# Altium schematic sheet Pg12_USB_UART.SchDoc: UART - USB CONSOLE & JTAG
size A3; DocumentNumber: 12; SheetNumber: 12; SheetTotal: 16
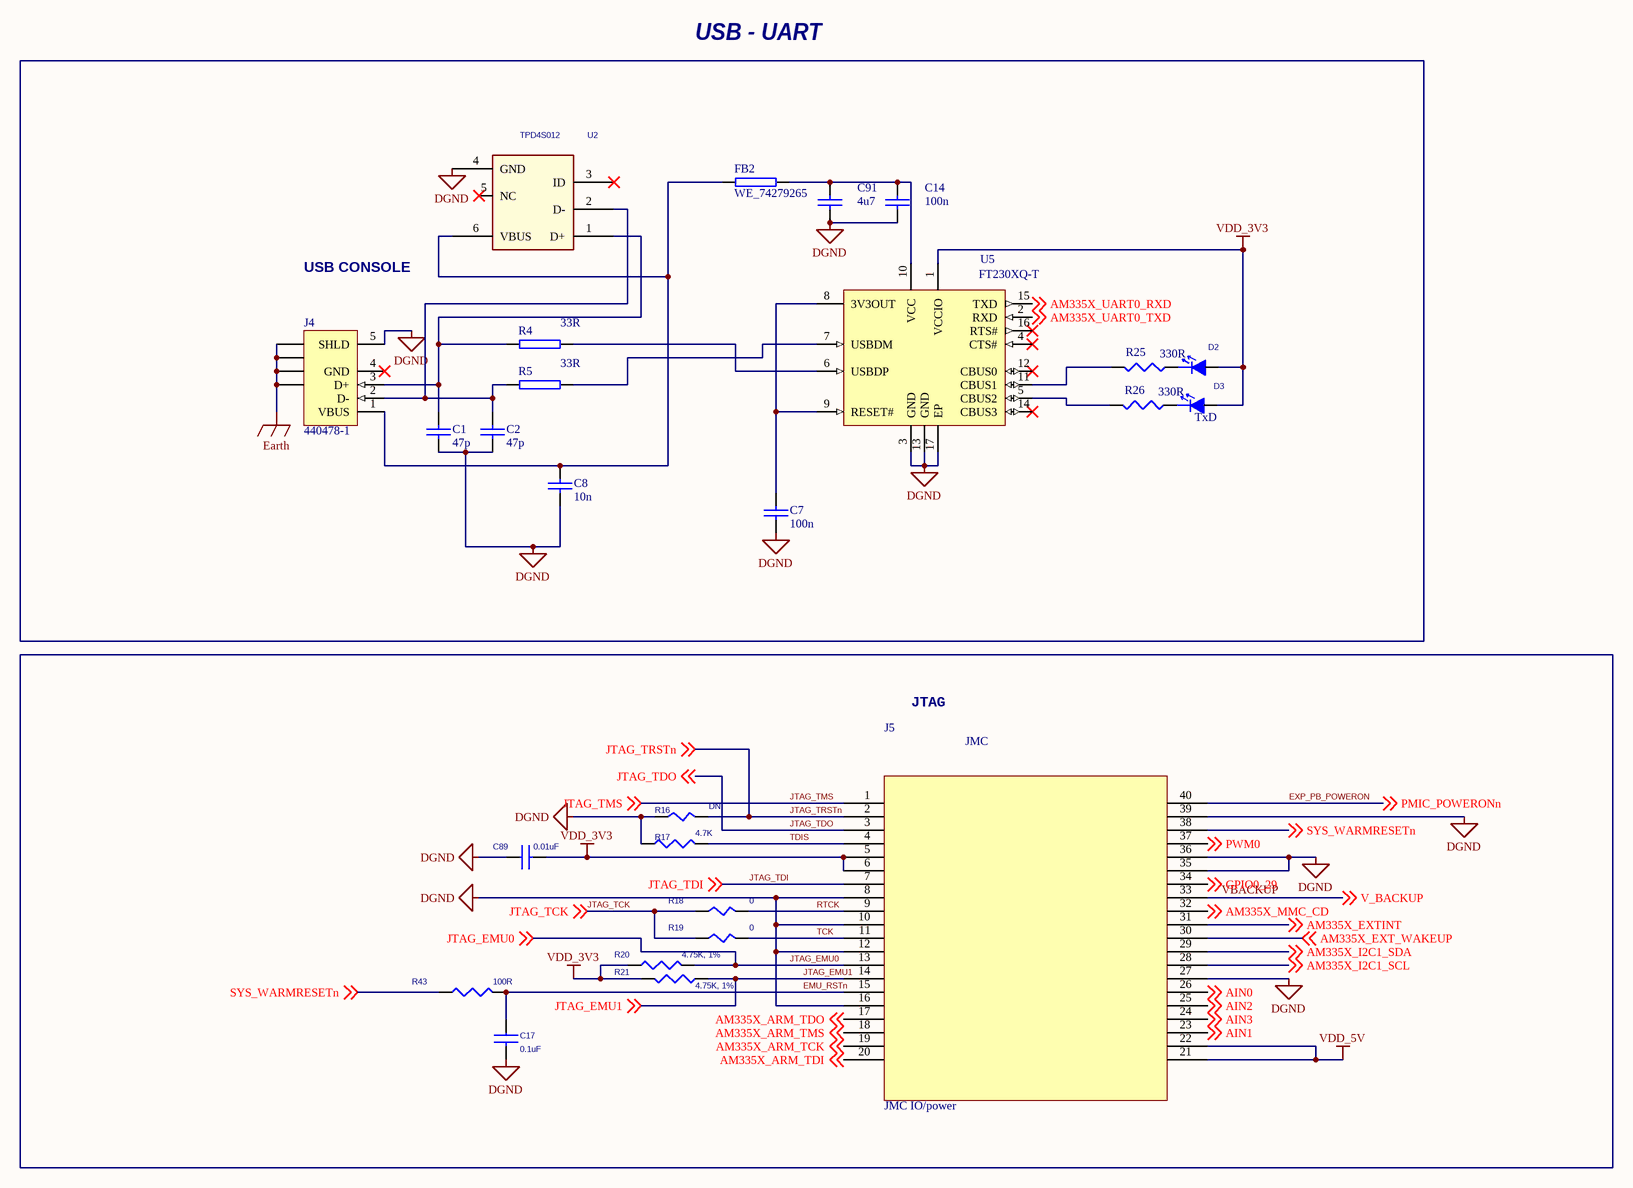
[diagram p0: Pg12_USB_UART.SchDoc]

## Parts
?  (no value)  (graphical)
C1  47p  [SM-7351-CAP-0402]
C2  47p  [SM-7351-CAP-0402]
C7  100n  [SM-7351-CAP-0402]
C8  10n  [SM-7351-CAP-0402]
C14  100n  [SM-7351-CAP-0402]
C17  0.1uF  [SM-7351-CAP-0402]
C89  0.01uF  [SM-7351-CAP-0402]
C91  4u7  [0603]
D2  Green LED  [0603]  (value not drawn)
D3  Green LED  [0603]  (value not drawn)
FB2  WE_74279265  [0603]
J4  440478-1  [440478]
J5  JMC IO/power  [40 Pin Female]
R4  33R  [SM-7351-RES-0402]
R5  33R  [SM-7351-RES-0402]
R16  DNI  [SM-7351-RES-0402]
R17  4.7K  [SM-7351-RES-0402]
R18  0  [SM-7351-RES-0402]
R19  0  [SM-7351-RES-0402]
R20  4.75K, 1%  [SM-7351-RES-0402]
R21  4.75K, 1%  [SM-7351-RES-0402]
R25  330R  [SM-7351-RES-0402]
R26  330R  [SM-7351-RES-0402]
R43  100R  [SM-7351-RES-0402]
U2  TPD4S012  [U_6_DRY]
U5  FT230XQ-T  [QFN-16_N]

## Blocks framed on the sheet
USB - UART: C1 C2 C7 C8 C14 C91 D2 D3 FB2 J4 R4 R5 R25 R26 U2 U5
JTAG: C17 C89 J5 R16-R21 R43

## Nets
DGND: C1.2 C2.2 C7.2 C8.2 C14.2 C17.2 C89.1 C91.2 J4.5(SHLD) J5.8 J5.10 J5.12 J5.16 J5.27 J5.35 J5.36 J5.39 R16.2(P2) R17.1 U2.4(GND) U5.3(GND) U5.13(GND) U5.17(EP)
Earth: J4.6(SHLD) J4.7(SHLD) J4.8(SHLD) J4.9(SHLD)
VDD_3V3: C89.2 D2.2(Anode) D3.2(Anode) J5.5 J5.6 R20.1 R21.2 U5.1(VCCIO)
VDD_5V: J5.21 J5.22
AIN0: J5.26 ; off-sheet AIN0
AIN1: J5.23 ; off-sheet AIN1
AIN2: J5.25 ; off-sheet AIN2
AIN3: J5.24 ; off-sheet AIN3
AM335X_ARM_TCK: J5.19 ; off-sheet AM335X_ARM_TCK
AM335X_ARM_TDI: J5.20 ; off-sheet AM335X_ARM_TDI
AM335X_ARM_TDO: J5.17 ; off-sheet AM335X_ARM_TDO
AM335X_ARM_TMS: J5.18 ; off-sheet AM335X_ARM_TMS
AM335X_EXT_WAKEUP: J5.30 ; off-sheet AM335X_EXT_WAKEUP
AM335X_EXTINT: J5.31 ; off-sheet AM335X_EXTINT
AM335X_I2C1_SCL: J5.28 ; off-sheet AM335X_I2C1_SCL
AM335X_I2C1_SDA: J5.29 ; off-sheet AM335X_I2C1_SDA
AM335X_MMC_CD: J5.32 ; off-sheet AM335X_MMC_CD
AM335X_UART0_RXD: U5.15(TXD) ; off-sheet AM335X_UART0_RXD
AM335X_UART0_TXD: U5.2(RXD) ; off-sheet AM335X_UART0_TXD
EMU_RSTn: C17.1 J5.15 R43.1(P1)
EXP_PB_POWERON: J5.40 ; off-sheet PMIC_POWERONn  [also labelled PMIC_POWERONn]
GPIO0_29: J5.34 ; off-sheet GPIO0_29
JTAG_EMU0: J5.13 R20.2 ; off-sheet JTAG_EMU0
JTAG_EMU1: J5.14 R21.1 ; off-sheet JTAG_EMU1
JTAG_TCK: R18.2(P2) R19.2(P2) ; off-sheet JTAG_TCK
JTAG_TDI: J5.7 ; off-sheet JTAG_TDI
JTAG_TDO: J5.3 ; off-sheet JTAG_TDO
JTAG_TMS: J5.1 ; off-sheet JTAG_TMS
JTAG_TRSTn: J5.2 R16.1(P1) ; off-sheet JTAG_TRSTn
PWM0: J5.37 ; off-sheet PWM0
RTCK: J5.9 R18.1(P1)
SYS_WARMRESETn: J5.38 R43.2(P2) ; off-sheet SYS_WARMRESETn
TCK: J5.11 R19.1(P1)
TDIS: J5.4 R17.2
VBACKUP: J5.33 ; off-sheet V_BACKUP  [also labelled V_BACKUP]
NetC1_1: C1.1 J4.3(D+) R4.2 U2.1(D+)
NetC2_1: C2.1 J4.2(D-) R5.2 U2.2(D-)
NetC7_1: C7.1 U5.8(3V3OUT) U5.9(RESET#)
NetC8_1: C8.1 FB2.1 J4.1(VBUS) U2.6(VBUS)
NetC14_1: C14.1 C91.1 FB2.2 U5.10(VCC)
NetD2_1: D2.1(Cathode) R25.2(P2)
NetD3_1: D3.1(Cathode) R26.2(P2)
NetR4_1: R4.1 U5.6(USBDP)
NetR5_1: R5.1 U5.7(USBDM)
NetR25_1: R25.1(P1) U5.11(CBUS1)
NetR26_1: R26.1(P1) U5.5(CBUS2)

Not connected (* = marked no-connect by the designer): J4 4(GND)*; U2 3(ID)* 5(NC)*; U5 4(CTS#)* 12(CBUS0)* 14(CBUS3)* 16(RTS#)*

## Notes on the sheet
- USB CONSOLE
- (near D3) TxD
- Embedded Vision Systems Group
- School of Electrical and Electronic Engineering
- Size
- Title
- Document Number
- Rev
- Date:
- Sheet
- of
- (in symbol JMC 40-pin) JMC

## Library data of the parts
? = Title Block Address(1): UoM title block
C1 C2 C7 C8 C14 C91 = CAP: NON-POLARISED CAP
C17 = 0.1uFCapacitor16V10%0402: PartName: 0.1uF16V10%SMD0402; Mfr: Kemet; MfrNum: C0402C104K4RACT; TIIntPartnumber: 1C0089; Vendor: Digikey; Cost100: 0.11; Cost10K: 0.015; DescriptiveText: Capacitor 0.1uF 16V 10% 0402 X7R
C89 = 0.01uFCapacitor16V10%0402_Dup1: Mfr: Panasonic; PartName: 0.01uF16V10%SMD0402; MfrNum: ECJ-0YB1C103K; TIIntPartnumber: 1C0012; PN: 0402YC103KAT2A; TN: 207-0054-000; Vendor: Digikey; Cost100: 0.00; Cost10K: 0.015; DescriptiveText: Capacitor 0.01uF 16V 10% 0402
D2 D3 = LED_Green: TIIntPartnumber: 1F0008; MfrNum: 598-8170-107F; Mfr: Dialight; PartName: LEDGreen2x1.5; DescriptiveText: LED Green SMD 20mA 2V 0805; Cost10K: 0.0370; Cost100: 0.081; Vendor: Digikey
FB2 = WE_74279265: Wurth Eleckronik 0603 ferrite bead pn 74279265
J4 = 440478-1: USB 2.0, Right Angle, SMT, A Type, Receptacle, 5 Position, Black; ContactMaterial: Phosphor Bronze; ContactPlating: Gold (30) over Nickel; PCB_Layout: Complies with manufacturer's recommendation.; DrillSize: Corresponds to nominal value.; PanelGround: Without; Published: 15-Jul-2004; DatasheetDocument: 15-Nov-2002; PackageDocument: 15-Nov-2002; PackageReference: 440478; Publisher: Altium Limited; HousingMaterial: Thermoplastic; ComponentLink1Description: Manufacturer Link; ComponentLink1URL: http://www.tycoelectronics.com/; ComponentLink2Description: Packaging Specification; ComponentLink2URL: http://ecommas.tycoelectronics.com/commerce/DocumentDelivery/DDEController?Action=showdoc&DocId=Customer+Drawing%7F440478%7FB%7Fpdf%7FEnglish%7FC_440478_B.pdf
J5 = JMC 40-pin: JST JMC 40 pin connector
R4 R5 = RES: RESISTOR
R16 R18 R19 = ZeroOhmResistor1/16W0402_Dup4: Resistor Zero ohm Jumper 0402; TIIntPartnumber: 1R0098; MfrNum: ERJ-2GE0R00X; Mfr: Panasonic; PartName: ZeroohmSMD0402; Cost10K: 0.0020; Cost100: 0.08; Vendor: Digikey; Descriptive_Text: Resistor Zero ohm Jumper 0402; DescriptiveText: Resistor Zero ohm Jumper 0402
R17 R20 R21 = 4.75KohmResistor1/16W1%0402: PartName: 4.75Kohm1/10W1%smd0402; Mfr: Panasonic-ECG; MfrNum: ERJ-2RKF4751X; TIIntPartnumber: 1R0250; Part Number: RES_4.75K_1/16W_1%_0402; Vendor: Digikey; Cost100: 0.02; Cost10K: 0.00132; DescriptiveText: Resistor 4.75KOHM 1/10W 1% 0402 SMD
R25 R26 = 1MOhmResistor1/16W0402: PartName: 1Mohm1/16W1%SMD0402; Mfr: Stackpole Electronics; MfrNum: RMCF0402FT1M00; TIIntPartnumber: 1R0182; Vendor: Digikey; Cost100: 0.0105; Cost10K: 0.00275; DescriptiveText: Resistor 1Mohm 1/16W 1% 0402
R43 = 100ohm1/16W1%SMD0402: TIIntPartnumber: 1R0236; MfrNum: RMCF0402JT100R; Mfr: Stackpole Electronics; PartName: 100ohm1/16W5%0402; DescriptiveText: Resistor 100ohm 1/16W 5% 0402; Cost10K: 0.00132; Cost100: 0.011; Vendor: Digikey
U2 = TPD4S012: ESD 4channel USB Interface; Mfr: TI; MfrNum: TPD4S012DRY; TIIntPartnumber: 1A0233; Vendor: Digikey; Cost100: 0.76; Cost10K: 0.12; DescriptiveText: ESD 4channel USB Interface; PartName: TPD4S012; Descriptive_Text: ESD 4channel USB Interface
U5 = FT230XQ-T: USB to Basic UART Interface Chip, UHCI/OHCI/EHCI Compatible, USB 2.0 Compatible, -40 to +85 degC, 16-Pin QFN, Pb-Free, Tray; Manufacturer: FTDI; DatasheetVersion: ver 1.2, Feb-2013; PackageVersion: Feb-13; PackageReference: QFN-16; PackageDescription: 16-Pin Quad Flat No-Lead, 4x4 mm Body, 0.65 mm Pitch; Code_JEDEC: MO-220WGGC; PartNumber: FT230XQ-T; ComponentLink1Description: Manufacturer URL; ComponentLink1URL: http://www.ftdichip.com/; ComponentLink2Description: Datasheet; ComponentLink2URL: http://www.ftdichip.com/Support/Documents/DataSheets/ICs/DS_FT230X.pdf; ComponentLink3Description: FT230X Product Page; ComponentLink3URL: www.ftdichip.com/Products/ICs/FT230X.html